# EAGLE design UAV_expansion_board_v4.1 (EAGLE 9.5.2)
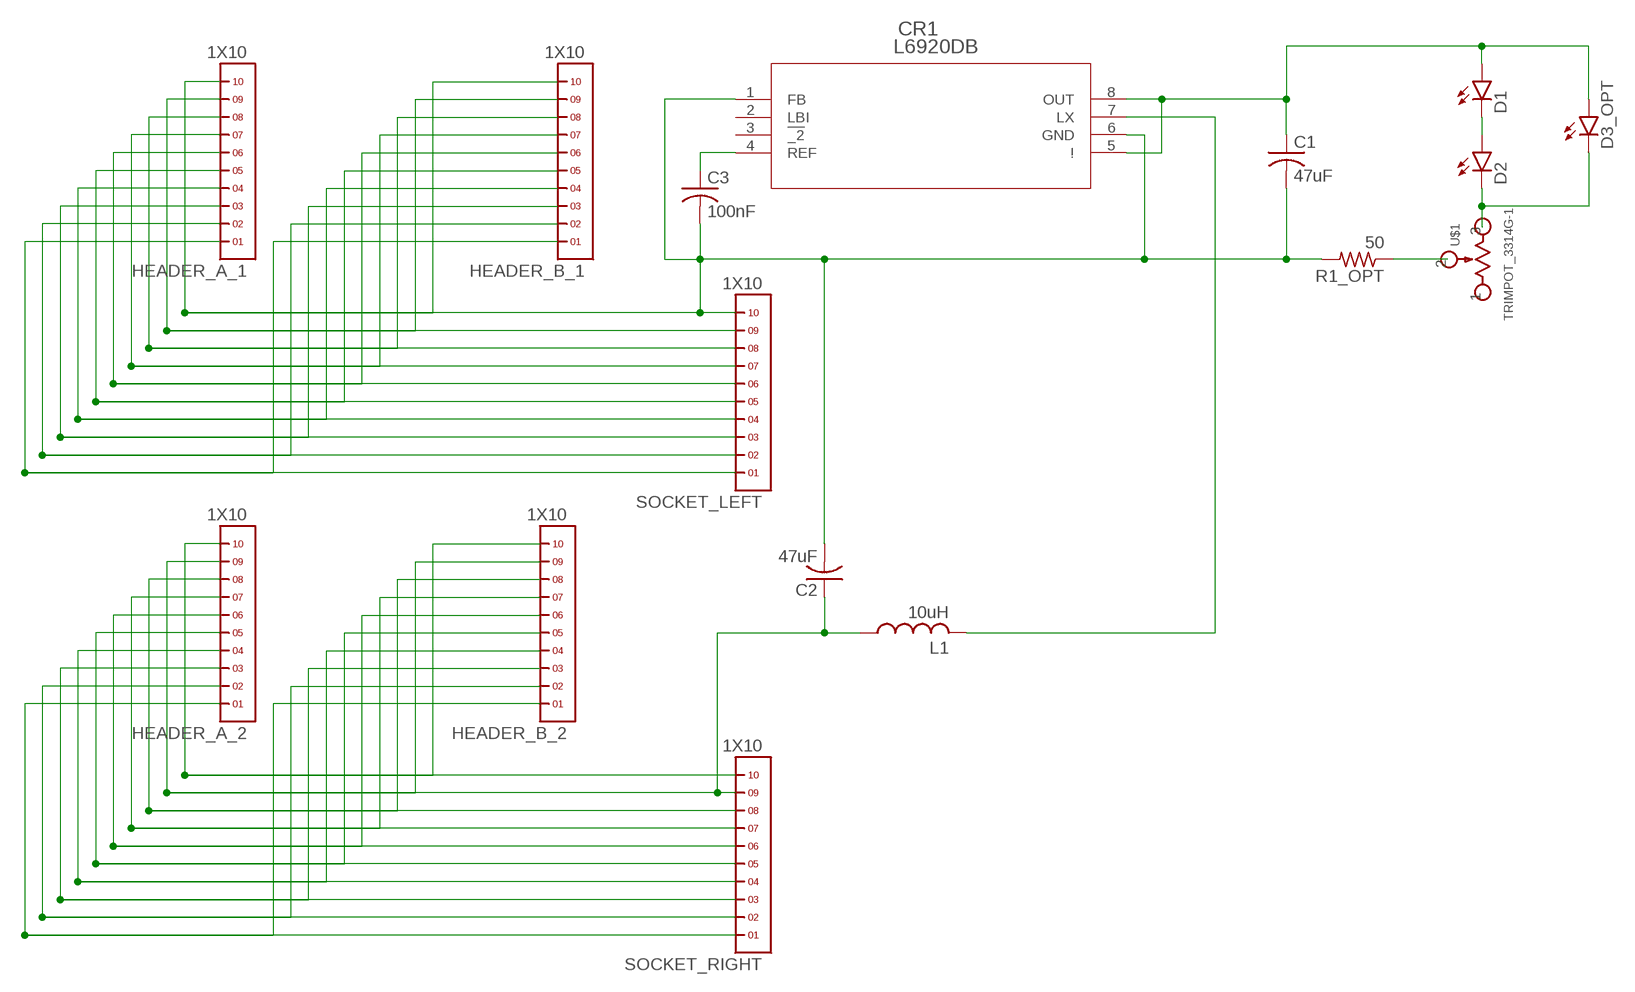
[diagram p0: schematic, sheet 1]

## Parts
C1  47uF  C-US_1206C1206  [C1206]
C2  47uF  C-US_1206C1206  [C1206]
C3  100nF  C-US_1206C1206  [C1206]
CR1  L6920DB  [MSOP-8]
D1  SFH4243-Q1R2  [SFH4243-Q1R2]
D2  SFH4243-Q1R2  [SFH4243-Q1R2]
D3_OPT  SFH4243-Q1R2  [SFH4243-Q1R2]
HEADER_A_1  1X10  [1X10]
HEADER_A_2  1X10  [1X10]
HEADER_B_1  1X10  [1X10]
HEADER_B_2  1X10  [1X10]
L1  10uH  L-US_1210R1210  [R1210]
R1_OPT  50  R-US_0805R0805  [R0805]
SOCKET_LEFT  1X10  [1X10]
SOCKET_RIGHT  1X10  [1X10]
U$1  TRIMPOT_3314G-1  [3314G-1]

## Nets
N$1: HEADER_A_1.1 HEADER_B_1.1 SOCKET_LEFT.1
N$2: HEADER_A_1.2 HEADER_B_1.2 SOCKET_LEFT.2
N$3: HEADER_A_1.3 HEADER_B_1.3 SOCKET_LEFT.3
N$4: HEADER_A_1.5 HEADER_B_1.5 SOCKET_LEFT.5
N$5: HEADER_A_1.4 HEADER_B_1.4 SOCKET_LEFT.4
N$6: HEADER_A_2.1 HEADER_B_2.1 SOCKET_RIGHT.1
N$7: HEADER_A_1.6 HEADER_B_1.6 SOCKET_LEFT.6
N$8: HEADER_A_2.2 HEADER_B_2.2 SOCKET_RIGHT.2
N$9: HEADER_A_2.3 HEADER_B_2.3 SOCKET_RIGHT.3
N$10: HEADER_A_1.7 HEADER_B_1.7 SOCKET_LEFT.7
N$11: HEADER_A_2.4 HEADER_B_2.4 SOCKET_RIGHT.4
N$12: HEADER_A_2.5 HEADER_B_2.5 SOCKET_RIGHT.5
N$13: HEADER_A_1.8 HEADER_B_1.8 SOCKET_LEFT.8
N$14: HEADER_A_2.6 HEADER_B_2.6 SOCKET_RIGHT.6
N$15: HEADER_A_2.7 HEADER_B_2.7 SOCKET_RIGHT.7
N$16: HEADER_A_1.9 HEADER_B_1.9 SOCKET_LEFT.9
N$17: HEADER_A_2.8 HEADER_B_2.8 SOCKET_RIGHT.8
N$18: C2.1 HEADER_A_2.9 HEADER_B_2.9 L1.1 SOCKET_RIGHT.9
N$19: C1.2 C2.2 C3.2 CR1.1(FB) CR1.6(GND) HEADER_A_1.10 HEADER_B_1.10 R1_OPT.2 SOCKET_LEFT.10
N$20: HEADER_A_2.10 HEADER_B_2.10 SOCKET_RIGHT.10
N$21: C3.1 CR1.4(REF)
N$22: C1.1 CR1.5(!) CR1.8(OUT) D1.A D3_OPT.A
N$23: CR1.7(LX) L1.2
N$24: D1.K(C) D2.A
N$25: D2.K(C) D3_OPT.K(C) U$1.3
N$26: R1_OPT.1 U$1.2
Unconnected: CR1.2(LBI) CR1.3(!_2) U$1.1

## Library data of the parts
C1-C3 = crazyflie:C-US_1206: CAPACITOR, American symbol
CR1 = crazyflie:L6920DB; BUILT_BY: EMA_UL_Team; MANUFACTURER_PART_NUMBER: L6920DB; VENDOR: STMicroelectronics
D1 D2 D3_OPT = crazyflie:SFH4243-Q1R2: SFH 4243 - High Power Infrared Emitter (940 nm) Version 1.4 Manufacturer: Osram Opto Semiconductor Manufacturer PN: SFH 4243-Q1R2 If - Forward Current: 70 mA Vf - Forward Voltage: 1.6 V Illumination Color: Infrared Viewing Angle: 120 deg Power Rating: 140 mW Operating Temp Range (C): -40 to +100 Package / Case: PLCC-2 SFH 4243 Datasheet <https://media.osram.info/media/resource/hires/osram-dam-2496186/SFH%204243.pdf>
HEADER_A_1 HEADER_A_2 HEADER_B_1 HEADER_B_2 SOCKET_LEFT SOCKET_RIGHT = crazyflie:1X10
L1 = crazyflie:L-US_1210: Inductor, American symbol; SPICEPREFIX: L
R1_OPT = crazyflie:R-US_0805: RESISTOR, American symbol
U$1 = crazyflie:TRIMPOT_3314G-1: Bourns 3314G-1 Trimmer Resistors - SMD https://www.bourns.com/docs/Product-Datasheets/3314.pdf

## Board
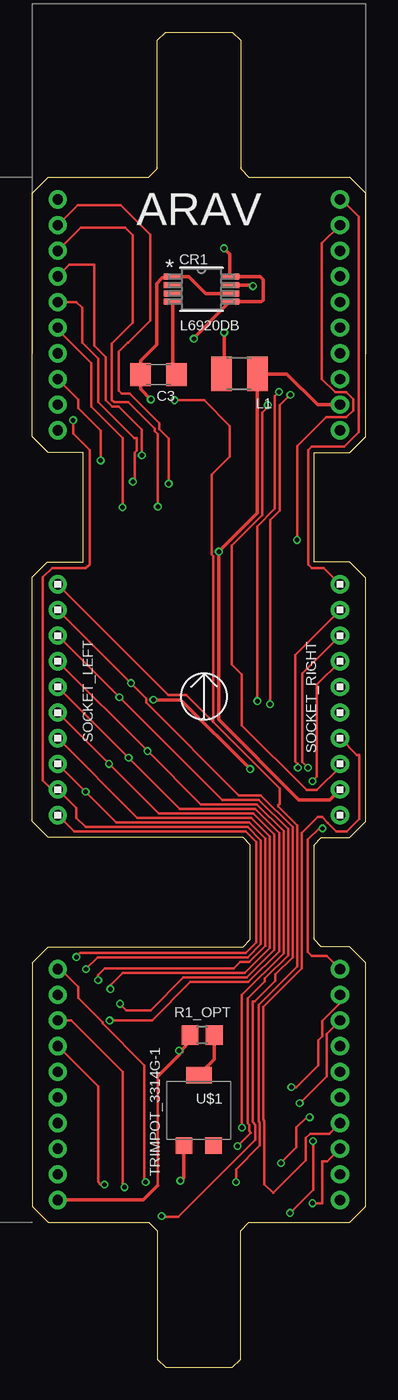
[diagram p1: board, top side]
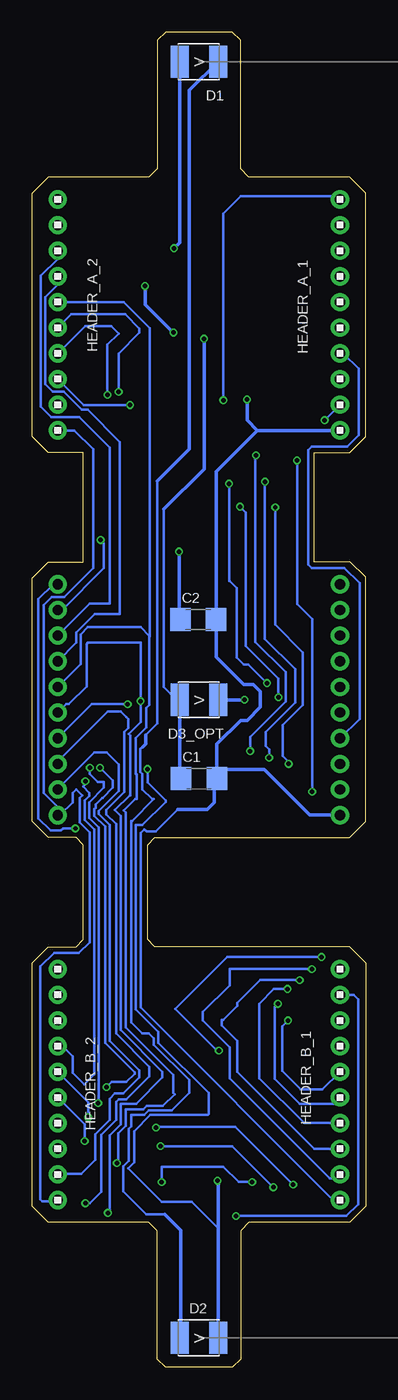
[diagram p2: board, bottom side, seen from below]

Size 26 x 104.1 mm. Coordinates in mm from the lower left corner, seen from the top.
Outline: 0,72.55 0,91.55 1.25,92.8 9.1,92.8 9.75,93.45 9.75,103.45 10.4,104.1 15.6,104.1 16.25,103.45 16.25,93.45 16.9,92.8 24.75,92.8 26,91.55 26,72.55 24.75,71.3 22,71.3 22,62.8 24.75,62.8 26,61.55 26,42.55 24.75,41.3 22.55,41.3 22,40.75 22,33.35 22.55,32.8 24.75,32.8 26,31.55 26,12.55 24.75,11.3 16.9,11.3 16.25,10.65 16.25,0.65 15.6,0 10.4,0 9.75,0.65 9.75,10.65 9.1,11.3 1.25,11.3 0,12.55 0,31.55 1.25,32.8 16.45,32.8 17,33.35 17,40.75 16.45,41.3 1.25,41.3 0,42.55 0,61.6 1.2,62.8 4,62.8 4,71.3 1.25,71.3 0,72.55
Copper layers (1*16): Top 0.035559375mm / dielectric 1.6mm / Bottom 0.035559375mm
Design rules "oshpark-2layer": minimum track width 6mil, minimum drill 10mil, track to track 6mil, track to pad 6mil, pad to pad 6mil, via to via 6mil, smd to smd 6mil, copper to edge 15mil, drill to drill 6mil, minimum pad ring 5mil, minimum via ring 5mil, stop-mask expansion 2.5mil, vias tented up to drill 0mil, thermal gap 10mil

### Footprints (pad centres in the part's own frame; a part is rotated, then mirrored left to right if it is on the bottom)
C1206 = smd 1.6 x 1.8: 1 -1.4,0; 2 1.4,0
MSOP-8 = smd 1.411 x 0.466: 1 -2.223,0.975; 2 -2.223,0.325; 3 -2.223,-0.325; 4 -2.223,-0.975; 5 2.223,-0.975; 6 2.223,-0.325; 7 2.223,0.325; 8 2.223,0.975
SFH4243-Q1R2 = smd 2.5 x 1.4: A 0,1.5; K 0,-1.5
1X10 = drill 0.8 pad 1.422: 1 -9,0; 2 -7,0; 3 -5,0; 4 -3,0; 5 -1,0; 6 1,0; 7 3,0; 8 5,0; 9 7,0; 10 9,0
R1210 = smd 1.6 x 2.7: 1 -1.4,0; 2 1.4,0
R0805 = smd 1.3 x 1.5: 1 -0.95,0; 2 0.95,0
3314G-1 = smd 1.3 x 1.3: 1 -1.15,2.75; 3 1.15,2.75 | smd 2 x 1.3: 2 0,-2.75

### Placement (x,y rotation side)
C1  13,45.9 0 bottom
C2  13.05,58.3 0 bottom
C3  9.85,77.4 180 top
CR1  13.2,84.05 0 top
D1  13,101.8 90 bottom
D2  13,2.3 90 bottom
D3_OPT  13,52.05 90 bottom
HEADER_A_1  2,82.05 270 bottom
HEADER_A_2  24,82.05 270 bottom
HEADER_B_1  2,22.05 270 bottom
HEADER_B_2  24,22.05 270 bottom
L1  16.15,77.45 180 top
R1_OPT  13.25,25.9 180 top
SOCKET_LEFT  2,52.05 270 top
SOCKET_RIGHT  24,52.05 270 top
U$1  13,20.05 180 top

### Tracks (layer width: path | path; a pad name or v marks a point on that pad's centre or on a via)
N$1  (via drill 0.35)
  Top 0.2: v8.85,14.45 8.75,14.55 8.75,23.57 5.5,26.82 5.5,26.9 3.6,28.8 3.6,29.65 2.2,31.05 HEADER_B_1.1 | v15.9,14.45 15.9,15.45 17.75,17.31 17.75,19.08 17.65,19.18 17.65,28.25 20.65,31.25 20.65,42.26 19.2,43.72 19.2,43.85 19.29,43.94 19.29,45.14 14.12,50.32 | SOCKET_LEFT.1 10.62,52.43 12.01,52.43 14.12,50.32 | 14.12,50.32 14.12,63.25 14,63.37 14,69.6 15.4,71 15.4,73.4 13.4,75.4 v11.1,75.4
  Bottom 0.2: v8.85,14.45 9.9,14.45 11.1,15.65 15.9,15.65 v15.9,14.45 | v11.1,75.4 11.1,89.95 9.75,91.3 2.25,91.3 HEADER_A_1.1
N$2  (via drill 0.35)
  Top 0.2: v10.1,11.8 10.15,11.75 11.4,11.75 17.4,17.75 17.4,18.93 17.2,19.13 17.2,28.55 17.35,28.55 18.95,30.15 18.95,30.63 20.3,31.98 20.3,42.12 17.82,44.6 16.12,44.6 8.9,51.82 8.9,52.15 v7.7,53.35 SOCKET_LEFT.2 | v10.65,68.9 10.65,72.4 9.9,73.15 9.9,73.6 7.6,75.9 7,75.9 6.75,76.15 6.75,79.2 7.45,79.9 7.5,79.9 9.2,81.6 9.2,88.3 6.9,90.6 3.55,90.6 HEADER_A_1.2
  Bottom 0.2: v10.1,11.8 1.5,11.8 0.6,12.7 0.6,28.7 0.95,29.05 HEADER_B_1.2 | v7.7,53.35 9.15,54.8 9.5,54.8 10.05,55.35 10.05,60.75 10.6,61.3 10.65,61.3 v10.65,68.9
N$3  (via drill 0.35)
  Top 0.2: v7.2,14.05 7.05,14.2 7.05,23.05 3.05,27.05 HEADER_B_1.3 | v16,17.25 17.05,18.3 16.9,18.45 16.9,18.93 16.8,19.03 16.8,28.75 18.15,30.1 18.15,30.33 19.95,32.13 19.95,41.97 17.67,44.25 14.8,44.25 v6.8,52.25 SOCKET_LEFT.3 | HEADER_A_1.3 3.8,88.85 7.25,88.85 7.85,88.25 7.85,81.45 6.22,79.83 6.22,75.42 6.4,75.25 7.5,75.25 9.55,73.2 9.55,73 9.8,72.75 v9.8,67.1
  Bottom 0.2: v7.2,14.05 10.4,17.25 v16,17.25 | v6.8,52.25 6.8,53.7 9.35,56.25 9.35,66.65 v9.8,67.1
N$4  (via drill 0.35)
  Top 0.2: SOCKET_LEFT.5 v7.53,47.53 11.51,43.54 17.38,43.54 19.24,41.68 19.24,32.42 16.86,30.04 12.34,30.04 9.35,27.05 v6.05,27.05 | HEADER_A_1.5 3.45,83.05 3.9,82.6 3.9,79.9 5.15,78.65 5.15,75.25 7.95,72.45 8.15,72.45 8.15,71.48 8,71.33 8,69.2 v7.85,69.05
  Bottom 0.2: HEADER_B_1.5 3.38,21.68 5.08,21.68 6.5,23.1 6.5,26.6 v6.05,27.05 | v7.53,47.53 7.53,48.17 7.8,48.45 7.8,49.55 5.5,51.85 5.5,54.45 7.85,56.8 v7.85,69.05
N$5  (via drill 0.35)
  Top 0.2: v5.65,14.25 5.35,14.25 5.15,14.45 5.15,21.9 HEADER_B_1.4 | SOCKET_LEFT.4 v9,48.05 13.15,43.89 17.52,43.89 19.59,41.83 19.59,32.28 16.35,29.03 v16.35,18.7 | HEADER_A_1.4 2.9,85.95 4.85,85.95 4.85,79.65 5.75,78.75 5.75,75.4 6.25,74.9 6.75,74.9 8.55,73.1 v8.55,71.1
  Bottom 0.2: v5.65,14.25 10.15,18.75 16.3,18.75 v16.35,18.7 | v9,48.05 9,49.15 6.25,51.9 6.25,52.48 6.25,54.2 8.6,56.55 8.6,71.05 v8.55,71.1
N$6  (via drill 0.35)
  Top 0.2: HEADER_B_2.1 22.95,32.1 21.8,32.1 21.5,32.4 21.5,40.85 21.5,40.88 21.5,41.15 22.37,42.02 v22.63,42.02 | HEADER_A_2.1 24.11,91.05 25.47,89.7 25.47,72.9 24.34,71.78 21.8,71.78 21.52,71.5 21.52,62.6 21.8,62.32 22.73,62.32 SOCKET_RIGHT.1
  Bottom 0.2: v22.63,42.02 23.58,42.02 23.75,41.85 24.55,41.85 25.5,42.8 25.5,59.9 24.35,61.05 SOCKET_RIGHT.1
N$7  (via drill 0.35)
  Top 0.2: v6.85,28.35 7.35,27.85 9.25,27.85 11.79,30.39 16.72,30.39 18.89,32.57 18.89,41.53 17.23,43.19 9.86,43.19 v6,47.05 SOCKET_LEFT.6 | HEADER_A_1.6 2,80.9 4.6,78.3 4.6,74.9 7.05,72.45 v7.05,67.05
  Bottom 0.2: HEADER_B_1.6 2.5,20.55 5.15,20.55 7.1,22.5 7.1,28.1 v6.85,28.35 | v6,47.05 6,47.2 6.45,47.65 6.45,50.1 4.9,51.65 4.9,55.75 7.05,57.9 v7.05,67.05
N$8  (via drill 0.35)
  Top 0.2: HEADER_B_2.2 24,28.41 22.6,27.01 22.6,25.8 22.3,25.5 22.3,23.55 20.6,21.85 v20.2,21.85 | v20.7,46.75 20.7,47.05 20.5,47.26 20.5,55.55 SOCKET_RIGHT.2 | HEADER_A_2.2 22.59,87.64 22.59,77.05 23.62,76.01 24.5,76.01 25.01,75.5 25.01,74.6 24.5,74.09 22.92,74.09 20.65,71.81 v20.65,64.5
  Bottom 0.2: v20.2,21.85 19.8,22.25 18.65,22.25 18,22.9 18,23 20.3,25.3 20.3,42.15 21.15,43 21.15,43.52 21.05,43.62 21.05,43.9 20.55,44.4 20.5,44.4 19.7,45.2 19.7,45.75 v20.7,46.75 | SOCKET_RIGHT.2 23.65,59.05 20.4,62.3 20.4,64.25 v20.65,64.5
N$9  (via drill 0.35)
  Top 0.2: v21.5,46.75 21.05,47.2 21.05,54.1 SOCKET_RIGHT.3 | v20.85,20.6 22.95,22.7 22.95,26 HEADER_B_2.3
  Bottom 0.2: v21.5,46.75 21.5,46.25 20.9,45.65 20.4,45.65 20.4,45.2 21.55,44.05 21.55,42.83 20.8,42.08 20.8,30.55 20.81,30.56 20.81,21.26 20.8,21.25 20.8,20.65 v20.85,20.6 | SOCKET_RIGHT.3 21.5,59.55 19.95,59.55 19.95,71.7 22.34,74.09 24.5,74.09 25.32,74.9 25.32,85.1 24,86.41 HEADER_A_2.3
N$10  (via drill 0.35)
  Top 0.2: SOCKET_LEFT.7 8.21,42.84 17.09,42.84 18.54,41.39 18.54,32.71 16.57,30.75 7.05,30.75 6.1,29.8 v6.1,29.5
  Bottom 0.2: v6.1,29.5 7.15,29.5 8.3,28.35 8.3,22.55 4.8,19.05 HEADER_B_1.7 | HEADER_A_1.7 1.75,79.05 0.55,77.85 0.55,72.68 1.45,71.78 4.2,71.78 4.48,71.5 4.48,62.6 4.2,62.32 1.66,62.32 0.48,61.14 0.48,50.57 SOCKET_LEFT.7
N$11  (via drill 0.35)
  Top 0.2: v21.85,45.7 22.2,46.05 22.2,53.25 SOCKET_RIGHT.4
  Bottom 0.2: HEADER_B_2.4 23.65,25.05 22.85,24.25 22.85,22.95 21.95,22.05 21.17,22.83 21.17,41.95 21.9,42.68 21.9,44.2 21.55,44.55 21.55,44.8 22.02,45.28 21.85,45.45 v21.85,45.7 | SOCKET_RIGHT.4 22.55,56.5 22.55,57.3 21.1,58.75 19.15,58.75 19.15,72.15 21.67,74.67 22.12,74.67 23.54,76.09 24.4,76.09 24.96,76.65 24.96,83.45 24,84.41 HEADER_A_2.4
N$12  (via drill 0.35)
  Top 0.2: v19.4,15.94 20.6,17.14 20.6,18.7 21.4,19.5 v21.63,19.5
  Bottom 0.2: v19.4,15.94 19.36,15.94 19.3,16 19.3,18.25 18.7,18.85 18.7,20.1 17.34,20.1 17.07,20.38 15.82,20.38 14.9,21.3 15,21.4 15,22.8 18.7,26.5 18.7,43.25 18.85,43.4 17.95,44.3 17.85,44.3 17.85,46.22 17.91,46.27 17.91,49.08 17.1,49.89 17.1,51.4 16.85,51.65 16.85,57 | v21.63,19.5 21.63,20.68 HEADER_B_2.5 | 16.85,57 16.82,56.97 16.82,81.02 18.85,83.05 HEADER_A_2.5 | 16.85,57 17.55,57.7 21.65,57.7 22.2,57.15 22.2,54.85 SOCKET_RIGHT.5
N$13  (via drill 0.35)
  Top 0.2: v5.15,30.2 5.15,30.6 5.65,31.1 15.7,31.1 16.21,31.61 16.94,31.61 18.19,32.86 18.19,41.24 16.94,42.49 6.56,42.49 v4.17,44.88 SOCKET_LEFT.8 | HEADER_A_1.8 3.6,75.45 3.6,74.8 5.35,73.05 v5.35,70.7
  Bottom 0.2: HEADER_B_1.8 4,17.05 10,23.05 10,25.45 11.2,26.65 11.2,27.1 11.1,27.1 10,28.2 10,28.4 8.2,30.2 v5.15,30.2 | v4.17,44.88 4.17,58.33 5.35,59.5 v5.35,70.7
N$14  (via drill 0.35)
  Top 0.2: v20.1,12.05 21.9,13.85 v21.9,17.65 | v17.55,51.95 17.55,65.56 18.93,66.94 18.93,75.73 v19.25,76.05
  Bottom 0.2: v20.1,12.05 19.95,12.05 19.95,18.1 19.1,18.95 19.1,20.55 17.9,20.55 15.85,22.6 15.85,23.05 19.1,26.3 19.1,43 19.55,43.45 18.4,44.6 18.35,44.6 18.35,49.25 18.48,49.38 17.55,50.3 v17.55,51.95 17.55,56.5 21.65,56.5 21.75,56.4 21.75,53.1 23.15,51.7 23.35,51.7 SOCKET_RIGHT.6 | v21.9,17.65 21.9,18.95 HEADER_B_2.6 | v19.25,76.05 19.25,79.05 17.65,80.65 17.65,81 18.75,82.1 22.95,82.1 HEADER_A_2.6
N$15  (via drill 0.35)
  Top 0.2: SOCKET_RIGHT.7 25.3,47.75 25.5,47.75 25.5,42.75 24.53,41.78 23.7,41.78 23.05,42.43 23.05,42.45 22.6,42.9 22.25,42.9 21,41.66 21,31.11 18,28.1 18,19.33 18.11,19.22 18.11,14.29 18.8,13.6 21.35,16.15 21.35,17.88 21.67,18.2 23.15,18.2 HEADER_B_2.7 | v18.55,51.7 18.55,66.07 19.28,66.8 19.28,75.03 20.1,75.85 v20.12,75.83
  Bottom 0.2: SOCKET_RIGHT.7 21.35,51.7 v18.55,51.7 | v20.12,75.83 20.12,79.72 19.25,80.6 19.82,81.17 21.88,81.17 HEADER_A_2.7
N$16  (via drill 0.35)
  Top 0.2: v4.2,31.05 5.12,31.97 16.8,31.97 17.83,33 17.83,41.09 16.8,42.13 4.17,42.13 3.45,42.85 3.45,43.6 SOCKET_LEFT.9 1.55,45.05 0.85,45.75 0.85,61.6 1.57,62.32 4.2,62.32 4.48,62.6 4.48,71.5 3.2,72.78 v3.2,73.85
  Bottom 0.2: v4.2,31.05 10.6,31.05 10.6,29.8 12.7,27.7 12.7,27.05 10.6,24.95 10.6,22.55 2.8,14.75 2.3,14.75 HEADER_B_1.9 | HEADER_A_1.9 3.05,74 3.2,74 v3.2,73.85
N$17  (via drill 0.35)
  Top 0.2: v21.85,12.8 22.6,12.8 22.6,16.05 23,16.05 HEADER_B_2.8 | v18.38,75.03 18.45,74.95 17.93,74.43 17.93,66.44 15.55,64.06 15.55,54.8 16.35,54 16.35,50.05 21.4,45 22.2,45 24,46.8 SOCKET_RIGHT.8
  Bottom 0.2: v18.38,75.03 21.98,75.03 HEADER_A_2.8 | v21.85,12.8 21.5,12.8 20.6,13.7 20.6,18.15 19.45,19.3 19.45,20.7 19.25,20.9 18.65,20.9 16.85,22.7 16.85,23.45 19.45,26.05 19.45,42.35 20.23,43.12 20.23,43.45 18.83,44.85 18.83,49.52 18.5,49.85 18.5,50.55 18.68,50.72 19.1,51.15 20.1,51.15 24,47.25 SOCKET_RIGHT.8
N$18  (via drill 0.35)
  Top 0.254: HEADER_A_2.9 22.25,75.05 19.85,77.45 L1.1 17.55,66.6 v14.55,63.6 14.55,50.5 20.8,44.25 23.2,44.25 SOCKET_RIGHT.9
  Bottom 0.2: HEADER_B_2.9 23.95,15.1 22.15,15.1 21.07,16.18 21.07,18.17 19.95,19.3 19.95,20.95 19.55,21.35 18.9,21.35 17.65,22.6 17.65,23.15 19.95,25.45 19.95,42.3 20.8,43.15 20.8,43.38 19.25,44.92 19.25,47 20.2,47.95 21.15,47.95 24,45.1 SOCKET_RIGHT.9
  Bottom 0.254: v14.55,63.6 14.55,58.4 C2.1
N$19  (via drill 0.35)
  Top 0.2: SOCKET_LEFT.10 3.27,41.78 16.65,41.78 17.48,40.95 17.48,33.15 16.65,32.32 3.77,32.32 v3.45,32 | v11.45,24.7 11.45,24.35 | 11.7,24.6 10.1,23 | 9.8,22.7 9.8,14.2
  Top 0.254: HEADER_B_1.10 8.65,13.05 9.8,14.2 | 11.7,24.6 11.7,24.8 12.3,25.4 R1_OPT.2 | 9.8,22.7 10.1,23 11.45,24.35 | CR1.6 13.53,83.72 12.22,85.02 CR1.1 10.89,84.94 10.13,84.94 9.7,84.5 9.7,79.75 8.45,78.5 C3.2 8.45,76.25 v9.25,75.45
  Bottom 0.2: 2.55,13.05 17.55,28.05 17.55,41.65 17.25,41.95 17.08,41.78 16.37,41.78 14.65,43.5 | v3.45,32 10.8,32 14.85,27.95 11.53,24.62 v11.45,24.7
  Bottom 0.254: HEADER_A_1.10 8.45,73.05 | 8.45,73.05 11.65,69.85 C2.2 11.65,55.4 9.5,53.25 8.75,53.25 8.2,52.7 8.2,51.5 9.25,50.45 9.75,50.45 11.6,48.6 C1.2 | C1.2 10.9,46.6 7.9,46.6 4.35,43.05 SOCKET_LEFT.10 | C1.2 11.8,45.7 11.8,44.05 12.35,43.5 14.65,43.5 | 2.55,13.05 HEADER_B_1.10 | v9.25,75.45 9.25,73.85 8.45,73.05
N$20
  Bottom 0.2: HEADER_B_2.10 24.1,12.95 25.2,12.95 25.35,13.1 25.35,31.25 24.28,32.32 22.35,32.32 21.52,33.15 21.52,41.7 22.3,42.48 22.3,44.4 22.1,44.6 22.57,45.08 22.85,44.8 22.85,44.05 23.85,43.05 SOCKET_RIGHT.10 24,43.69 25.1,44.78 25.1,59.42 24.45,60.06 23.49,60.06 21.25,62.3 21.25,71.6 22.7,73.05 HEADER_A_2.10
N$21
  Top 0.254: CR1.4 10.98,77.67 C3.1
N$22  (via drill 0.35)
  Top 0.254: v14.95,87.25 15.42,86.78 CR1.8 17.77,85.02 18,84.8 18,83.2 17.88,83.08 CR1.5 12.6,80.25 v12.6,80.2
  Bottom 0.2: 15.75,66.9 15.75,53.05 14.75,52.05
  Bottom 0.254: D1.A 14.5,87.7 v14.95,87.25 | v12.6,80.2 12.6,70.05 15.75,66.9 | 14.75,52.05 D3_OPT.A 14.5,46 C1.1
N$23  (via drill 0.35)
  Top 0.254: CR1.7 17.18,84.38 17.2,84.35 v17.2,84.3 | v14.97,80.67 14.97,77.67 L1.2
  Bottom 0.254: v17.2,84.3 17.2,82.85 15,80.65 v14.97,80.67
N$24
  Bottom 0.2: 15.65,11.95 17.1,11.95 18.88,13.73 18.88,15.67 18.45,16.1 18.45,18.6 18.25,18.8 18.25,19.7 17.25,19.7 16.92,20.03 15.12,20.03 13.75,21.4 13.75,22.4 16.5,25.15 16.5,25.65 16.9,26.05 17.41,26.05 18.25,26.9 18.25,42.6 18.2,42.6 16.5,44.3 16.65,44.3 17.4,45.05 17.4,46.27 17.55,46.42 17.55,48.2 17.38,48.38 | 16.25,69.1 16.25,50.2 17.15,49.3
  Bottom 0.254: D1.K 13.75,99.55 13.75,71.6 16.25,69.1 | 15.65,11.95 14.4,10.7 14.4,2.4 D2.A | 17.15,49.3 17.15,48.6 17.38,48.38
N$25  (via drill 0.35)
  Top 0.254: v11.55,14.55 11.8,14.8 11.8,17.25 U$1.3 | v9.45,52.05 11.6,52.05 v17,46.65
  Bottom 0.2: 11.5,10.4 11.5,10.85 13.55,12.9 15.9,12.9 18.52,15.53 18.05,16 18.05,18.39 16.77,19.67 12.33,19.67 12.25,19.75 12.25,21.4 16.15,25.3 16.15,26.15 17.9,27.9 17.9,42.3 17.4,42.3 15.6,44.1 15.6,44.2 17,45.6 v17,46.65
  Bottom 0.254: D2.K 11.5,10.4 11.5,14.5 v11.55,14.55 | D3_OPT.K v9.45,52.05
N$26
  Top 0.254: R1_OPT.1 14.2,24 U$1.2

### Text on the board
tPlace: ARAV